# EAGLE design iswba (EAGLE 5.10)
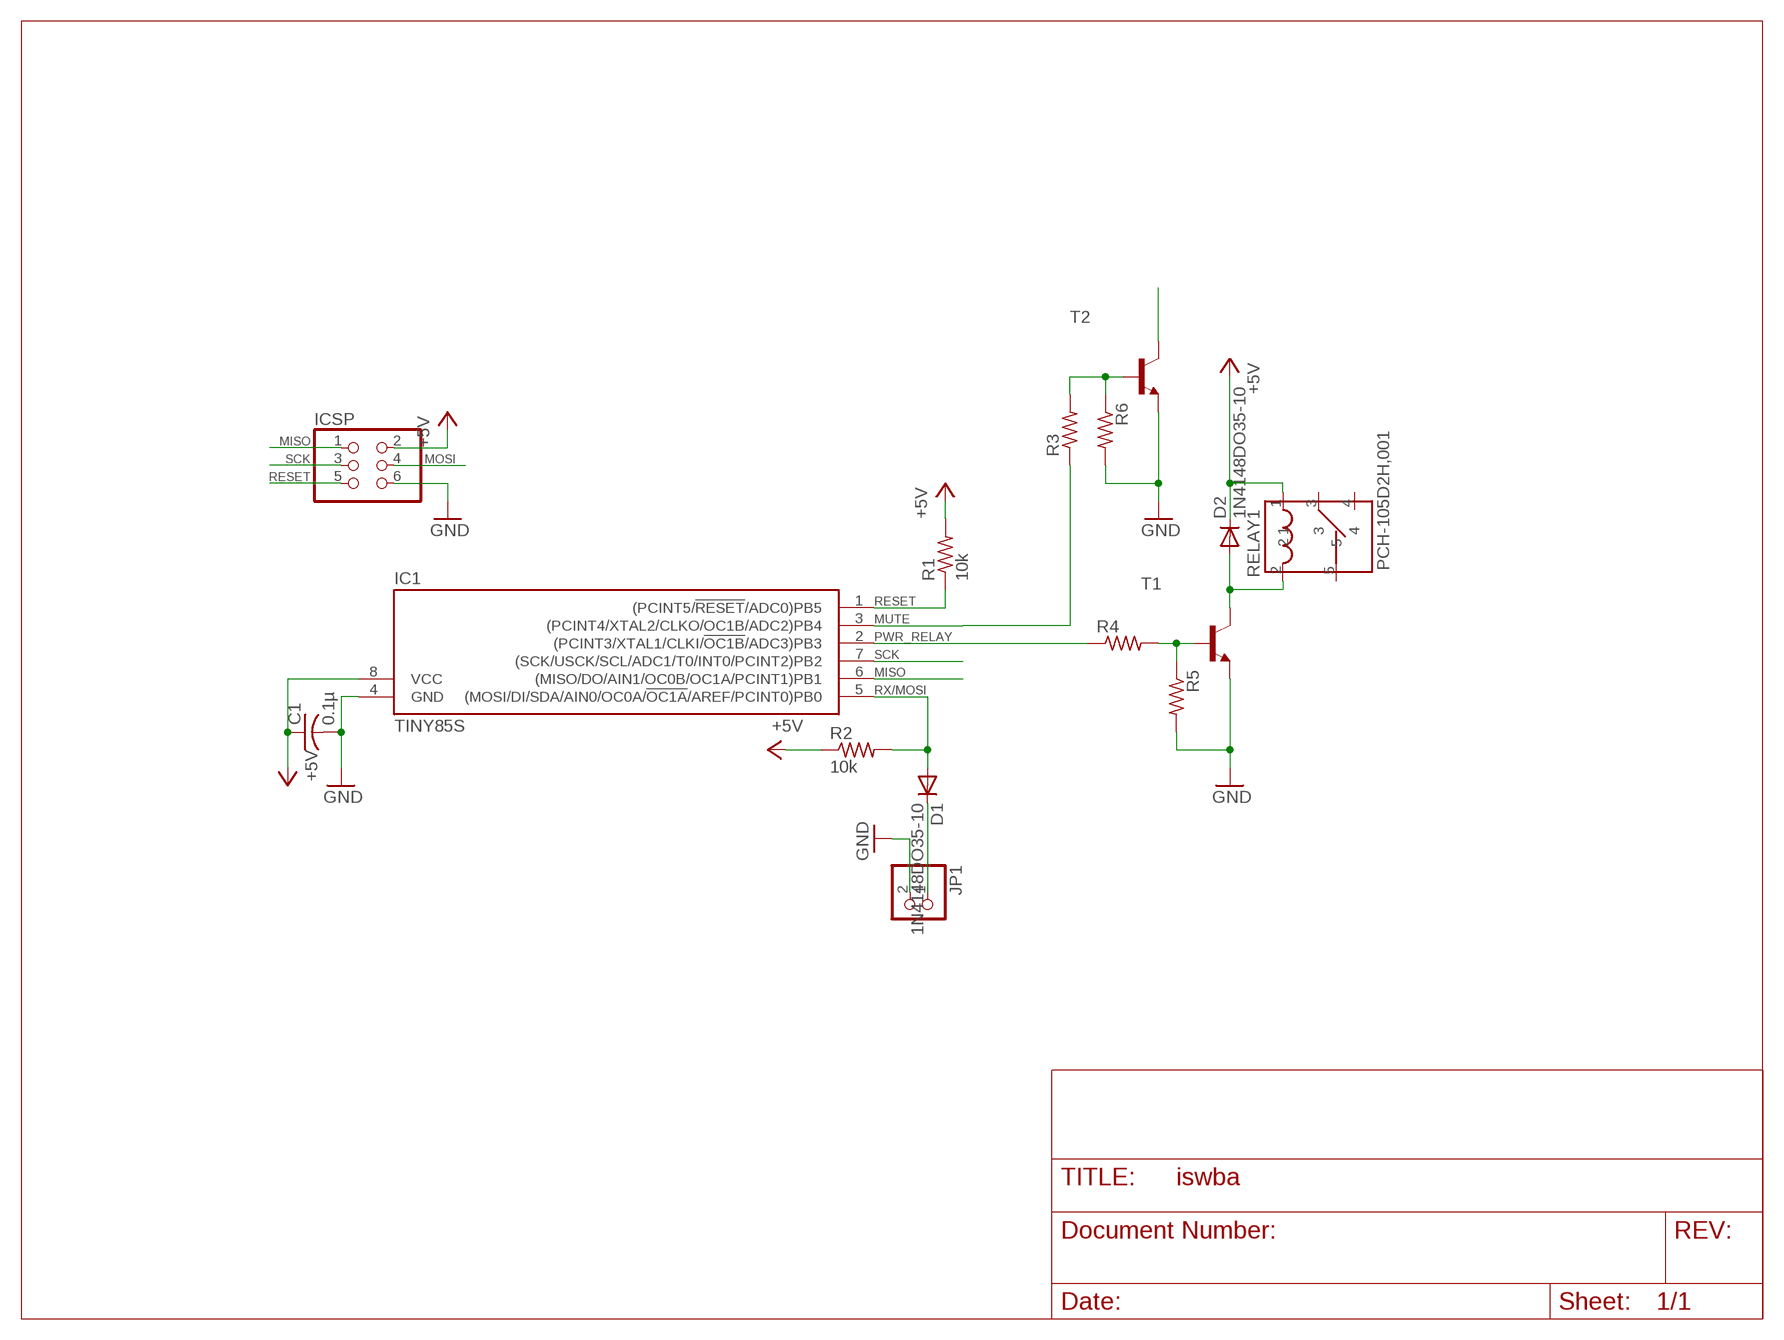
[diagram p0: schematic, sheet 1]

## Parts
C1  0.1µ  C-US025-025X050  [C025-025X050]
D1  1N4148DO35-10  [DO35-10]
D2  1N4148DO35-10  [DO35-10]
IC1  TINY85S  [SOIC8]
ICSP  PINHD-2X3  [2X03]
JP1  PINHD-1X2  [1X02]
R1  10k  R-US_0204/7  [0204/7]
R2  10k  R-US_0207/10  [0207/10]
R3  R-US_0207/10  [0207/10]
R4  R-US_0207/10  [0207/10]
R5  R-US_0207/10  [0207/10]
R6  R-US_0207/10  [0207/10]
RELAY1  PCH-105D2H,001  PCH-1XXXX  [PCH-1XXXX]
T1  2N4124-NPN-TO92-CBE  [TO92-CBE]
T2  2N4124-NPN-TO92-CBE  [TO92-CBE]

## Nets
+5V: C1.1 D2.C IC1.8(VCC) ICSP.2 R1.2 R2.1 RELAY1.1
GND: C1.2 ICSP.6 JP1.2 R5.2 R6.2 T1.E T2.E
MISO: IC1.6((MISO/DO/AIN1/OC0B/OC1A/PCINT1)PB1) ICSP.1
MOSI: ICSP.4
MUTE: IC1.3((PCINT4/XTAL2/CLKO/OC1B/ADC2)PB4) R3.1
N$1: D1.C JP1.1
N$2: R4.2 R5.1 T1.B
N$3: R3.2 R6.1 T2.B
N$4: D2.A RELAY1.2 T1.C
N$6: T2.C
PWR_RELAY: IC1.2((PCINT3/XTAL1/CLKI/!OC1B!/ADC3)PB3) R4.1
RESET: IC1.1((PCINT5/!RESET!/ADC0)PB5) ICSP.5 R1.1
RX/MOSI: D1.A IC1.5((MOSI/DI/SDA/AIN0/OC0A/!OC1A!/AREF/PCINT0)PB0) R2.2
SCK: IC1.7((SCK/USCK/SCL/ADC1/T0/INT0/PCINT2)PB2) ICSP.3
Unconnected: RELAY1.3 RELAY1.4 RELAY1.5

## Power pins joined to a net without a drawn wire
GND: IC1.4(GND)

## Library data of the parts
C1 = rcl:C-US: CAPACITOR, American symbol
D1 D2 = diode:1N4148: DIODE high speed (Philips)
IC1 = iswba:TINY85: MICROCONTROLLER 2.7 V 1 Kbytes FLASH 64 bytes EEPROM 4-channel 10 bit ADC
ICSP = pinhead:PINHD-2X3: PIN HEADER
JP1 = pinhead:PINHD-1X2: PIN HEADER
R1-R6 = rcl:R-US_: RESISTOR, American symbol
RELAY1 = iswba:PCH-1XXXX: Tyco PCH-105D2H,001
T1 T2 = transistor:*-NPN-: NPN Transistror BF959 corrected 2008.03.06

## Board
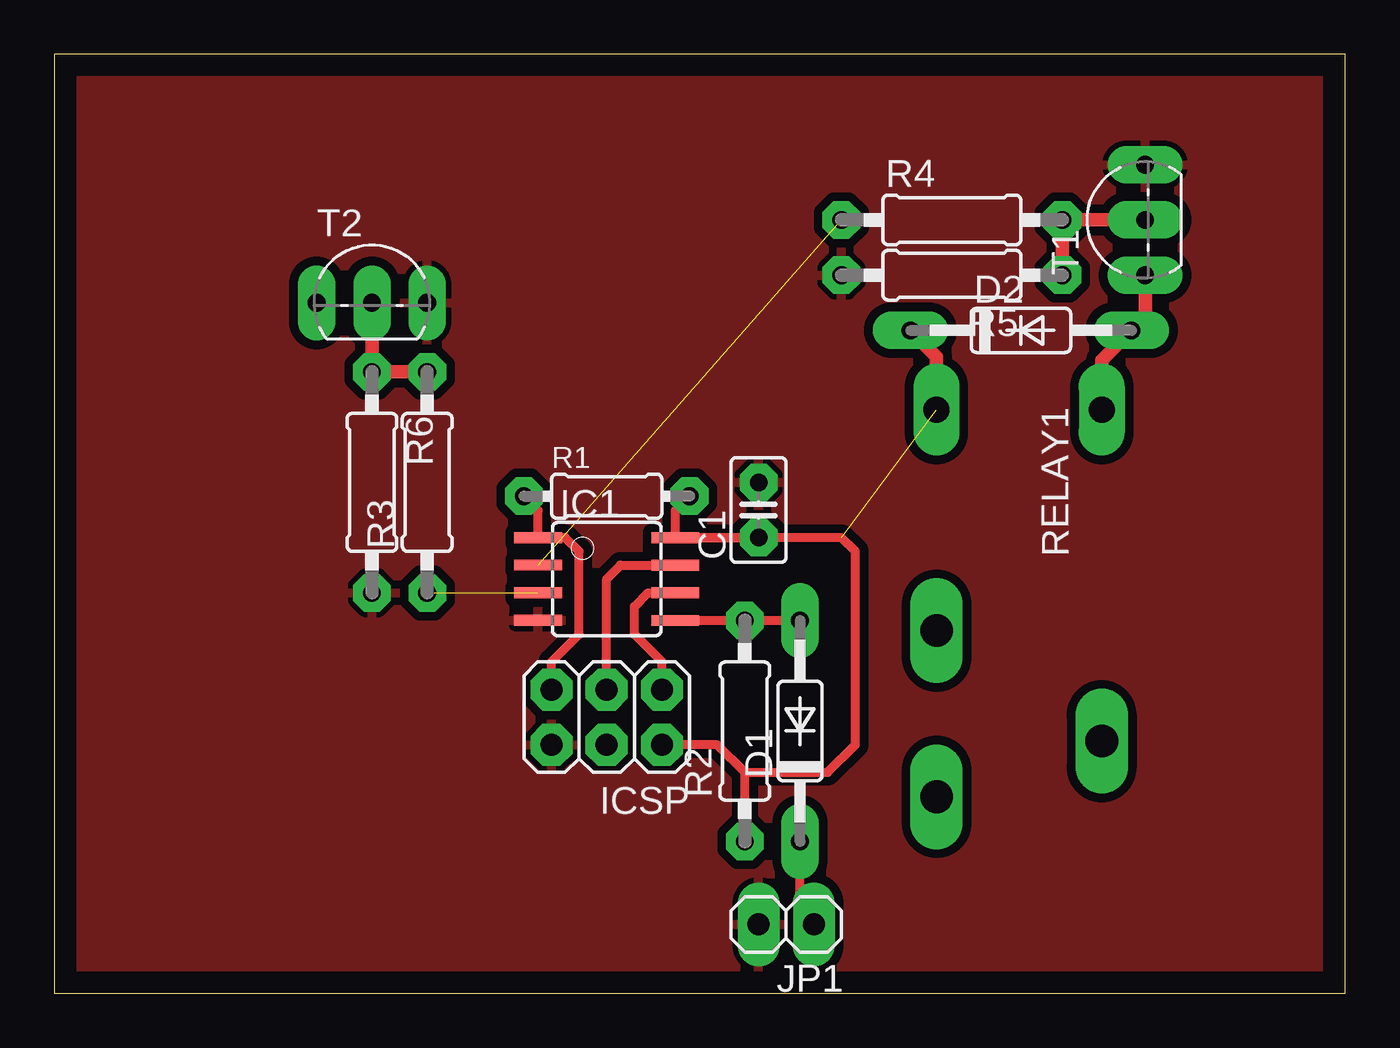
[diagram p1: board, top side]
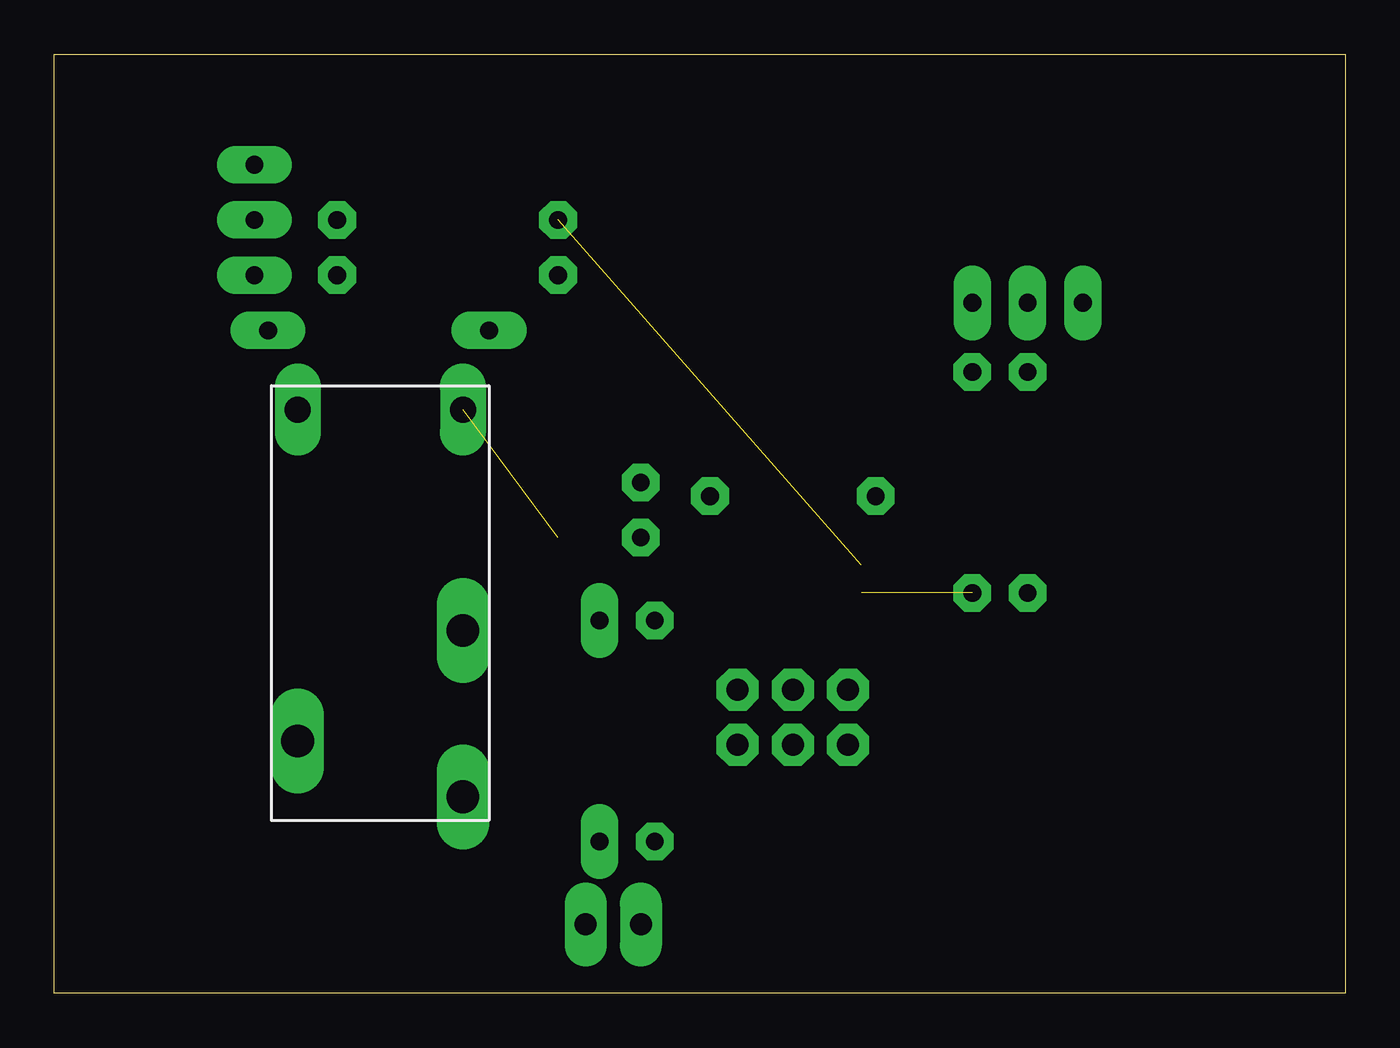
[diagram p2: board, bottom side, seen from below]

Size 59.36 x 43.17 mm. Coordinates in mm from the lower left corner, seen from the top.
Outline: 0,0 59.36,0 59.36,43.17 0,43.17 0,0
Copper layers (1*16): Top 0.035mm / dielectric 1.5mm / Bottom 0.035mm
Design rules "hobbyist-friendly": minimum track width 16mil, minimum drill 20mil, track to track 16mil, track to pad 8mil, pad to pad 8mil, via to via 16mil, smd to smd 8mil, copper to edge 40mil, drill to drill 8mil, minimum pad ring 18mil, minimum via ring 16mil, stop-mask expansion 4mil, vias tented up to drill 0mil, thermal gap 10mil

### Footprints (pad centres in the part's own frame; a part is rotated, then mirrored left to right if it is on the bottom)
C025-025X050 = drill 0.813 octagon: 1 -1.27,0; 2 1.27,0
DO35-10 = drill 0.813 long: A 5.08,0; C -5.08,0
SOIC8 = smd 0.5 x 2.2: 1 -1.905,-3.154; 2 -0.645,-3.154; 3 0.625,-3.154; 4 1.895,-3.154; 5 1.905,3.154; 6 0.635,3.154; 7 -0.635,3.154; 8 -1.905,3.154
2X03 = drill 1.016 octagon: 1 -2.54,-1.27; 2 -2.54,1.27; 3 0,-1.27; 4 0,1.27; 5 2.54,-1.27; 6 2.54,1.27
1X02 = drill 1.016 long: 1 -1.27,0; 2 1.27,0
0204/7 = drill 0.813 octagon: 1 -3.81,0; 2 3.81,0
0207/10 = drill 0.813 octagon: 1 -5.08,0; 2 5.08,0
PCH-1XXXX = drill 1.2 long: 1 1.1,1.2; 2 1.1,8.8 | drill 1.5 long: 3 11.26,1.2; 4 18.9,1.2; 5 16.34,8.8
TO92-CBE = drill 0.813 long: B 0,0; C -2.54,0; E 2.54,0

### Placement (x,y rotation side)
C1  32.38,22.23 90 top
D1  34.29,12.06 90 top
D2  44.45,30.48 0 top
IC1  25.4,19.05 270 top
ICSP  25.4,12.7 180 top
JP1  33.66,3.17 180 top
R1  25.4,22.86 0 top
R2  31.75,12.06 90 top
R3  17.14,23.5 90 top
R4  41.27,35.56 0 top
R5  41.27,33.02 180 top
R6  14.61,23.5 270 top
RELAY1  39.37,27.94 270 top
T1  50.16,35.56 90 top
T2  14.61,31.75 0 top

### Tracks (layer width: path | path; a pad name or v marks a point on that pad's centre or on a via)
+5V  (1 unrouted)
  Top 0.406: R1.2 28.55,22.2 IC1.8 | IC1.8 C1.1 | R2.1 31.75,10.16 | 31.75,10.16 30.48,11.43 ICSP.2 | IC1.8 36.2,20.95 36.83,20.32 36.83,11.43 35.56,10.16 31.75,10.16
  Top 0.61: D2.C 40.57,29.28 RELAY1.1
GND
  pour Top: 0,0 0,43.18 58.42,43.18 58.42,0
MISO
  Top 0.406: IC1.6 27.3,18.41 26.67,17.78 26.67,16.51 27.94,15.24 ICSP.1
MUTE  (1 unrouted)
N$1
  Top 0.406: D1.C 34.29,3.81 JP1.1
N$2
  Top 0.61: R5.1 R4.2 T1.B
N$3
  Top 0.61: T2.B R6.1 R3.2
N$4
  Top 0.61: T1.C 50.16,31.11 D2.A 48.17,29.12 RELAY1.2
PWR_RELAY  (1 unrouted)
RESET
  Top 0.406: R1.1 22.25,22.2 IC1.1 23.5,20.95 24.13,20.32 24.13,16.51 22.86,15.24 ICSP.5
RX/MOSI
  Top 0.406: IC1.5 R2.2 D1.A
SCK
  Top 0.406: ICSP.3 25.4,19.05 26.04,19.68 IC1.7